# Altium project laserdriver1.PrjPcb
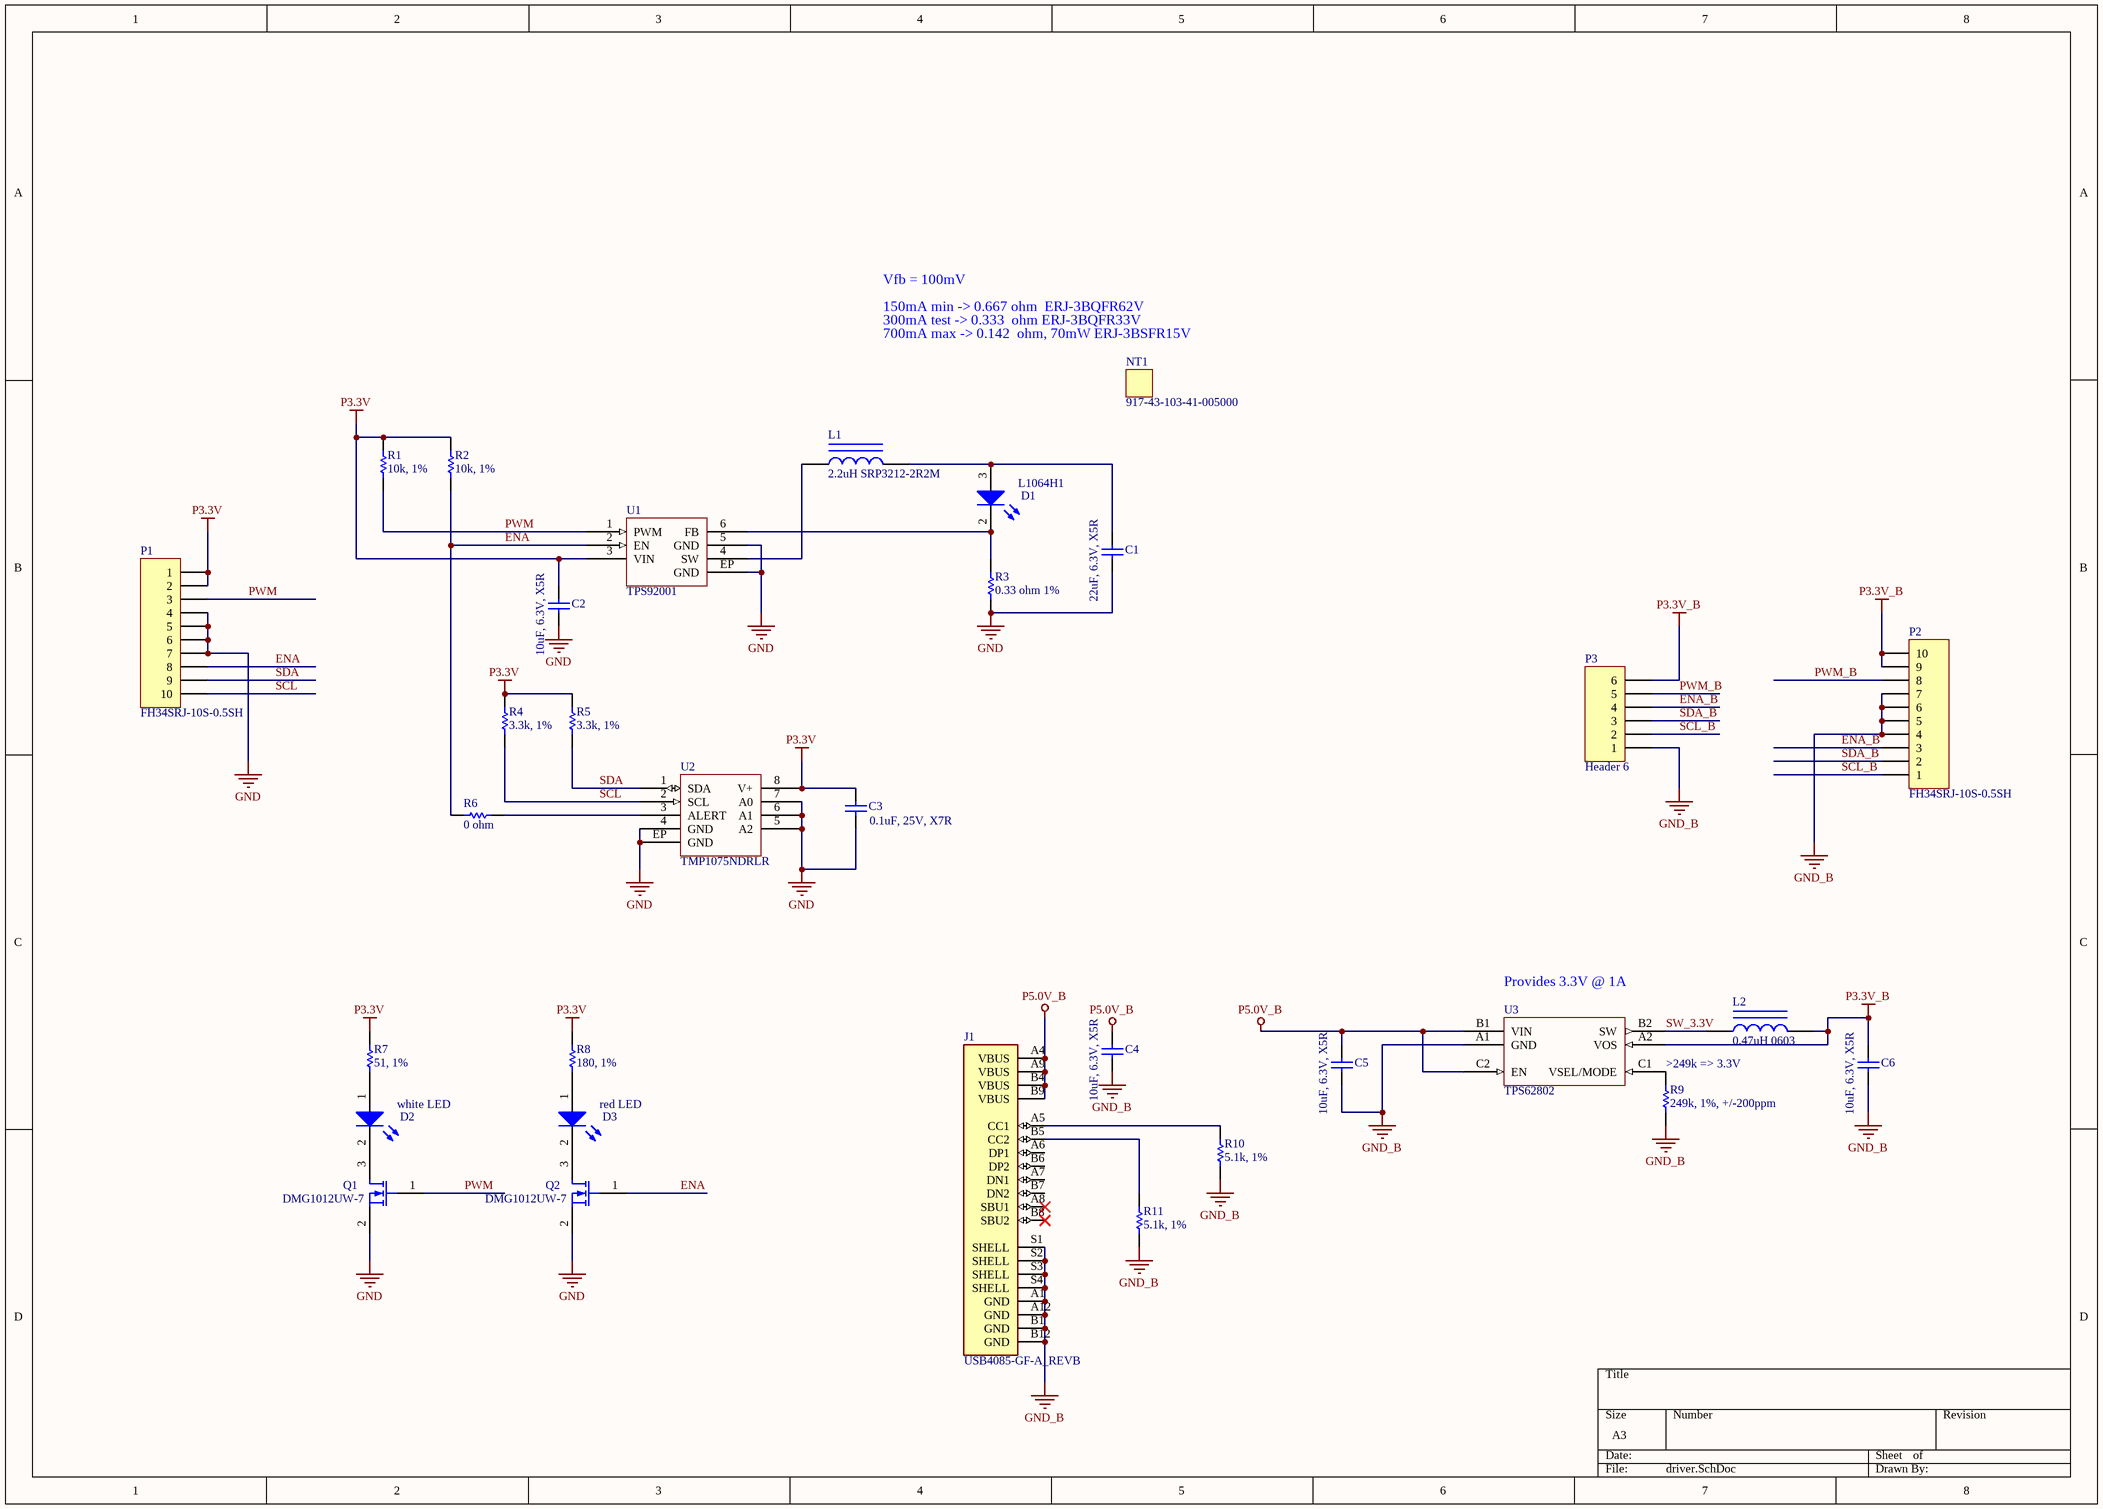
[diagram p0: driver.SchDoc]
1 sheet, 32 parts. Net scope: global (net labels, ports and power ports of the same name join across sheets).
Board file: laserdriver1.PcbDoc

## Sheet driver.SchDoc
size A3; SheetNumber: 1; SheetTotal: 1

### Parts
C1  22uF, 6.3V, X5R  [B_CAP0603]
C2  10uF, 6.3V, X5R  [B_CAP0603]
C3  0.1uF, 25V, X7R  [B_CAP0402]
C4  10uF, 6.3V, X5R  [B_CAP0603]
C5  10uF, 6.3V, X5R  [B_CAP0603]
C6  10uF, 6.3V, X5R  [B_CAP0603]
D1  L1064H1  [TO-CAN-MICROJACK]
D2  white LED  [B_LED0805]
D3  red LED  [B_LED0805]
J1  USB4085-GF-A_REVB  [GCT_USB4085-GF-A_REVB]
L1  2.2uH SRP3212-2R2M  [B_IND1210_BOURNES]
L2  0.47uH 0603  [B_IND0603]
NT1  917-43-103-41-005000
P1  FH34SRJ-10S-0.5SH  [HRS_FH34SRJ-10S-0.5SH(50)]
P2  FH34SRJ-10S-0.5SH  [HRS_FH34SRJ-10S-0.5SH(50)]
P3  Header 6  [HDR1X6]
Q1  DMG1012UW-7  [SOT323-3AN]
Q2  DMG1012UW-7  [SOT323-3AN]
R1  10k, 1%  [B_RES0402]
R2  10k, 1%  [B_RES0402]
R3  0.33 ohm 1%  [B_RES0603]
R4  3.3k, 1%  [B_RES0402]
R5  3.3k, 1%  [B_RES0402]
R6  0 ohm  [B_RES0402]
R7  51, 1%  [B_RES0603]
R8  180, 1%  [B_RES0603]
R9  249k, 1%, +/-200ppm  [B_RES0402]
R10  5.1k, 1%  [B_RES0603]
R11  5.1k, 1%  [B_RES0603]
U1  TPS92001  [TI-WSON65P200X80_HS-7N]
U2  TMP1075NDRLR  [TI-SON50P200X80_HS-9N]
U3  TPS62802  [BGA6C35P2X3_70X105X40_NSMD]

### Nets
GND: C1.2 C2.2 C3.2 P1.4 P1.5 P1.6 P1.7 Q1.2(S) Q2.2(S) R3.2 U1.5(GND) U1.EP(GND) U2.4(GND) U2.5(A2) U2.6(A1) U2.7(A0) U2.EP(GND)
GND_B: C4.2 C5.2 C6.2 J1.A1(GND) J1.A12(GND) J1.B1(GND) J1.B12(GND) J1.S1(SHELL) J1.S2(SHELL) J1.S3(SHELL) J1.S4(SHELL) P2.4 P2.5 P2.6 P2.7 P3.1 R9.2 R10.1 R11.1 U3.A1(GND)
P3.3V: C2.1 C3.1 P1.1 P1.2 R1.2 R2.2 R4.2 R5.2 R7.2 R8.2 U1.3(VIN) U2.8(V+)
P3.3V_B: C6.1 L2.2 P2.9 P2.10 P3.6 U3.A2(VOS)
P5.0V_B: C4.1 C5.1 J1.A4(VBUS) J1.A9(VBUS) J1.B4(VBUS) J1.B9(VBUS) U3.B1(VIN) U3.C2(EN)
ENA: P1.8 Q2.1(G) R2.1 R6.1 U1.2(EN)
ENA_B: P2.3 P3.4
PWM: P1.3 Q1.1(G) R1.1 U1.1(PWM)
PWM_B: P2.8 P3.5
SCL: P1.10 R4.1 U2.2(SCL)
SCL_B: P2.1 P3.2
SDA: P1.9 R5.1 U2.1(SDA)
SDA_B: P2.2 P3.3
SW_3.3V: L2.1 U3.B2(SW)
NetC1_1: C1.1 D1.3(A) L1.2
NetD1_2: D1.2(K) R3.1 U1.6(FB)
NetD2_1: D2.1(A) R7.1
NetD2_2: D2.2(K) Q1.3(D)
NetD3_1: D3.1(A) R8.1
NetD3_2: D3.2(K) Q2.3(D)
NetJ1_A5: J1.A5(CC1) R10.2
NetJ1_B5: J1.B5(CC2) R11.2
NetL1_1: L1.1 U1.4(SW)
NetR6_2: R6.2 U2.3(ALERT)
NetR9_1: R9.1 U3.C1(VSEL/MODE)

Not connected (* = marked no-connect by the designer): J1 A6(DP1) A7(DN1) A8(SBU1)* B6(DP2) B7(DN2) B8(SBU2)*

### Notes on the sheet
- 150mA min -> 0.667 ohm  ERJ-3BQFR62V
- Vfb = 100mV
- 700mA max -> 0.142  ohm, 70mW ERJ-3BSFR15V
- 300mA test -> 0.333  ohm ERJ-3BQFR33V
- (near U3) Provides 3.3V @ 1A
- (near R9) >249k => 3.3V

### Library data of the parts
C1 = Cap Semi: Capacitor (Semiconductor SIM Model); MPN: CL10A226KQ8NRNE; VENDOR: Samsung; MYPN: C-226-6.3-X5R-0603
C2 C4-C6 = Cap Semi: Capacitor (Semiconductor SIM Model); MPN: CL10A106MQ8NNNC; VENDOR: Samsung; MYPN: C-106-6.3-X5R-0603
C3 = Cap Semi: Capacitor (Semiconductor SIM Model); MPN: CL05A104KA5NNNC; VENDOR: Samsung; MYPN: C-104-25-X5R-0402
D1 = LED2: Typical RED, GREEN, YELLOW, AMBER GaAs LED; VENDOR: Thorlabs; MYPN: D-LASER-1065NM-TO5; MPN: L1064H1
D2 = LED2: Typical RED, GREEN, YELLOW, AMBER GaAs LED; MPN: EAST2012WA1; VENDOR: Everlight; MYPN: D-LED-WHITE1-0805
D3 = LED2: Typical RED, GREEN, YELLOW, AMBER GaAs LED; VENDOR: ANY; MYPN: D-LED-RED-0805; MPN: ANY
J1 = USB4085-GF-A_REVB: USB-C (USB TYPE-C) USB 2.0 Receptacle Connector 24 (16+8 Dummy) Position Through Hole, Right Angle, low cost, 3.46mm profile, 16 pin, horizontal, Top mount; MF: Global Connector Technology; VENDOR: GCT; Package: None; Price: None; Value: *; SnapEDA_Link: https://www.snapeda.com/parts/USB4085-GF-A/Global+Connector+Technology/view-part/?ref=snap; MP: USB4085-GF-A; Availability: In Stock; Check_prices: https://www.snapeda.com/parts/USB4085-GF-A/Global+Connector+Technology/view-part/?ref=eda; MPN: USB4085-GF-A
L1 = Inductor Iron: Magnetic-Core Inductor; VENDOR: Bournes; MYPN: L-SRP3212-2R2M; MPN: SRP3212-2R2M
L2 = Inductor Iron: Magnetic-Core Inductor; MPN: TFM160808ALC-R47MTAA; VENDOR: TDK; MYPN: L-TFM160808ALC-R47MTAA
NT1 = NOTE: Placeholder for non-board BOM items; MYPN: NT-917-43-103-41-005000; VENDOR: Mil-Max; MPN: 917-43-103-41-005000
P1 P2 = Header 10: Header, 10-Pin; VENDOR: Hirose; MYPN: J-FH34SRJ-10S-0.5SH(50/99); LatestRevisionDate: 17-Jul-2002; LatestRevisionNote: Re-released for DXP Platform.; Publisher: Altium Limited; MPN: FH34SRJ-10S-0.5SH
P3 = Header 6: Header, 6-Pin; LatestRevisionDate: 17-Jul-2002; LatestRevisionNote: Re-released for DXP Platform.; Publisher: Altium Limited
Q1 Q2 = MOSFET-N: N-Channel MOSFET; VENDOR: Diodes Inc; MYPN: Q-DMG1012UW-7; Published: 8-Jun-2000; LatestRevisionDate: 17-Jul-2002; LatestRevisionNote: Re-released for DXP Platform.; PackageVersion: 1995/1996; PackageReference: E3; Publisher: Altium Limited; MPN: DMG1012UW-7
R1 R2 R4 R5 = Res1: Resistor; VENDOR: ANY; MYPN: R-103-1P-1_16W-0402; MPN: ANY
R3 = Res1: Resistor; MPN: ERJ-3BQFR33V; VENDOR: Panasonic; MYPN: R-0R33-1P-1_4W-0603
R6 = Res1: Resistor; VENDOR: ANY; MYPN: R-0R0-1P-1_16W-0402; MPN: ANY
R7 R8 = Res1: Resistor; VENDOR: ANY; MYPN: R-510-1P-1_16W-0603; MPN: ANY
R9 = Res1: Resistor; MPN: RC0402FR-07249KL; VENDOR: Yageo; MYPN: R-2493-1P-1_16W-0402
R10 R11 = Res1: Resistor; MPN: RC0603FR-075K1L; VENDOR: Yageo; MYPN: R-512-1P-1_16W-0603
U1 = TPS92201: 1.5A high efficiency synchronous buck LED driver
U2 = TMP1075N: Temperature sensor, I2C
U3 = TPS62802: Buck regulator, 4MHz, 0.6A, 1.8V-3.3V, low Iq; MPN: TPS62802YKAR; VENDOR: TI; MYPN: U-TPS62802YKA(T/R)